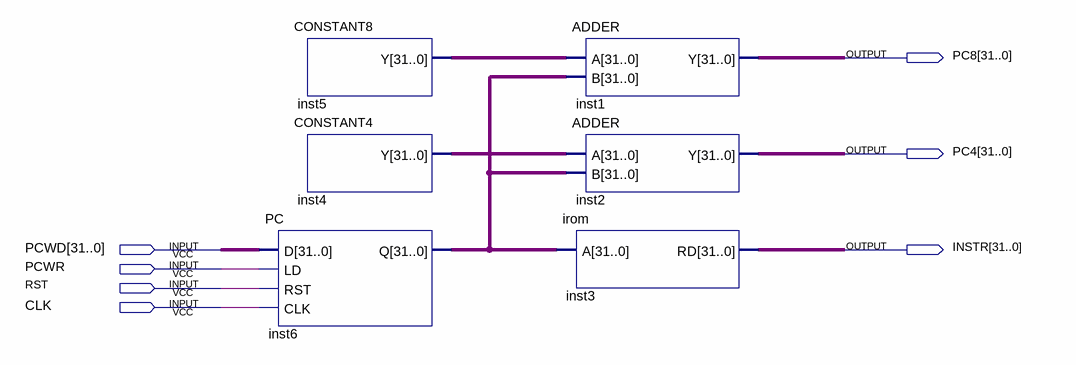
[diagram p0: schematic sheet]
// Quartus schematic fetch.bdf as structural Verilog: 6 symbols, 7 pins
module fetch (
  input  [31:0] PCWD,
  input  PCWR,
  input  RST,
  input  CLK,
  output [31:0] PC8,
  output [31:0] PC4,
  output [31:0] INSTR
);

  wire [31:0] inst4_y, inst5_y, inst6_q;

  PC inst6 (.D(PCWD), .LD(PCWR), .RST(RST), .CLK(CLK), .Q(inst6_q));
  CONSTANT8 inst5 (.Y(inst5_y));
  CONSTANT4 inst4 (.Y(inst4_y));
  ADDER inst1 (.A(inst5_y), .B(inst6_q), .Y(PC8));
  ADDER inst2 (.A(inst4_y), .B(inst6_q), .Y(PC4));
  irom inst3 (.A(inst6_q), .RD(INSTR));
endmodule
